# Altium project 新苗.PrjPCB
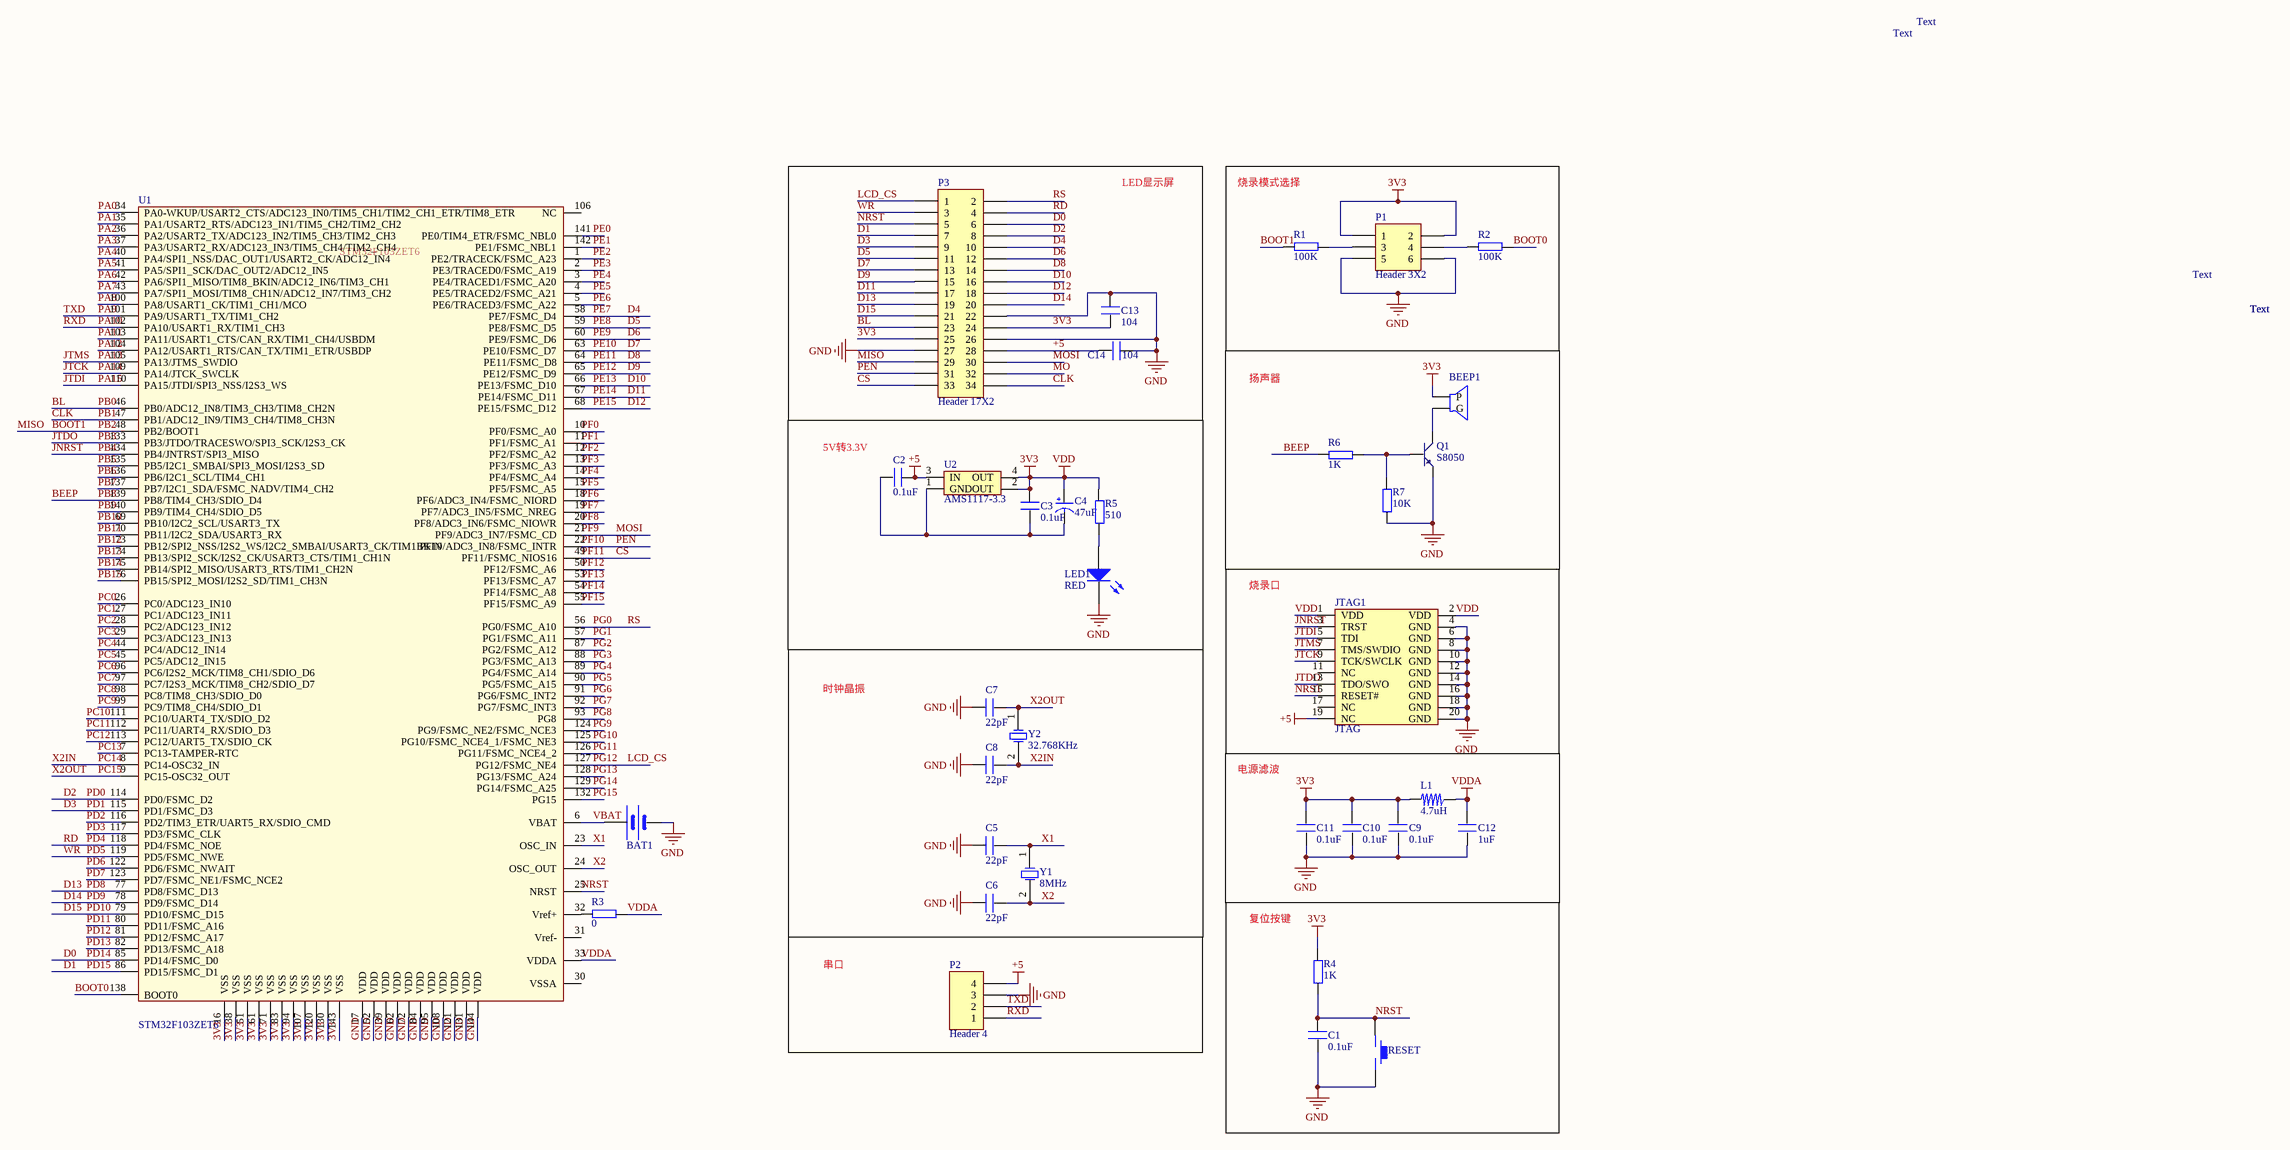
[diagram p0: 新苗.SchDoc]
1 sheet, 35 parts. Net scope: global (net labels, ports and power ports of the same name join across sheets).
Board file: 新苗.PcbDoc

## Sheet 新苗.SchDoc
size A3

### Parts
BAT1  BATT  [BATM]  (value not drawn)
BEEP1  BEEP  [BELL-5]  (value not drawn)
C1  0.1uF  [0603P]
C2  0.1uF  [0603P]
C3  0.1uF  [0603P]
C4  47uF  [CC6.56.5]
C5  22pF  [0603P]
C6  22pF  [0603P]
C7  22pF  [0603P]
C8  22pF  [0603P]
C9  0.1uF  [0603P]
C10  0.1uF  [0603P]
C11  0.1uF  [0603P]
C12  1uF  [0603P]
C13  104  [0603P]
C14  104  [0603P]
JTAG1  JTAG  [JTAG_20]
L1  4.7uH  [L_SOP74]
LED1  RED  [SMDLED]
P1  Header 3X2  [HDR2X3]
P2  Header 4  [HDR1X4]
P3  Header 17X2  [HDR2X17]
Q1  S8050  [SOT-23R]
R1  100K  [0603P]
R2  100K  [0603P]
R3  0  [0603P]
R4  1K  [0603P]
R5  510  [0603P]
R6  1K  [0603P]
R7  10K  [0603P]
RESET  KEY_M  [KEY_M]  (value not drawn)
U1  STM32F103ZET6  [LQFP144]
U2  AMS1117-3.3  [AMS1117]
Y1  8MHz  [XTAL_US]
Y2  32.768KHz  [XTAL_US]

### Blocks framed on the sheet
LED显示屏: C13 C14 P3
烧录模式选择: P1 R1 R2

### Nets
3V3: BEEP1.1(P) C3.2 C4.1(VCC) C9.2 C10.2 C11.2 C13.1 JTAG1.1(VDD) JTAG1.2(VDD) L1.2 P1.1 P1.2 P3.24 P3.25 R4.2 R5.2 U1.16(VSS) U1.38(VSS) U1.51(VSS) U1.61(VSS) U1.71(VSS) U1.83(VSS) U1.94(VSS) U1.107(VSS) U1.120(VSS) U1.130(VSS) U1.143(VSS) U2.2(OUT) U2.4(OUT)  [also labelled VDD]
+5: C2.1 C14.2 JTAG1.19(NC) P2.4 P3.28 U2.3(IN)
GND: BAT1.2(GND) C1.1 C5.1 C6.1 C7.1 C8.1 C9.1 C10.1 C11.1 C12.1 C13.2 C14.1 JTAG1.4(GND) JTAG1.6(GND) JTAG1.8(GND) JTAG1.10(GND) JTAG1.12(GND) JTAG1.14(GND) JTAG1.16(GND) JTAG1.18(GND) JTAG1.20(GND) LED1.2(K) P1.5 P1.6 P2.3 P3.22 P3.26 P3.27 Q1.1(E) R7.1 RESET.2 U1.17(VDD) U1.39(VDD) U1.52(VDD) U1.62(VDD) U1.72(VDD) U1.84(VDD) U1.95(VDD) U1.108(VDD) U1.121(VDD) U1.131(VDD) U1.144(VDD)
VDDA: C12.2 L1.1 R3.1 U1.33(VDDA)
BEEP: R6.1 U1.139(PB8/TIM4_CH3/SDIO_D4)  [also labelled PB8]
BL: P3.23 U1.46(PB0/ADC12_IN8/TIM3_CH3/TIM8_CH2N)  [also labelled PB0]
BOOT0: R2.1 U1.138(BOOT0)
BOOT1: P3.29 R1.2 U1.48(PB2/BOOT1)  [also labelled MISO, PB2]
CLK: P3.34 U1.47(PB1/ADC12_IN9/TIM3_CH4/TIM8_CH3N)  [also labelled PB1]
CS: P3.33 U1.49(PF11/FSMC_NIOS16)  [also labelled PF11]
D0: P3.6 U1.85(PD14/FSMC_D0)  [also labelled PD14]
D1: P3.7 U1.86(PD15/FSMC_D1)  [also labelled PD15]
D2: P3.8 U1.114(PD0/FSMC_D2)  [also labelled PD0]
D3: P3.9 U1.115(PD1/FSMC_D3)  [also labelled PD1]
D4: P3.10 U1.58(PE7/FSMC_D4)  [also labelled PE7]
D5: P3.11 U1.59(PE8/FSMC_D5)  [also labelled PE8]
D6: P3.12 U1.60(PE9/FSMC_D6)  [also labelled PE9]
D7: P3.13 U1.63(PE10/FSMC_D7)  [also labelled PE10]
D8: P3.14 U1.64(PE11/FSMC_D8)  [also labelled PE11]
D9: P3.15 U1.65(PE12/FSMC_D9)  [also labelled PE12]
D10: P3.16 U1.66(PE13/FSMC_D10)  [also labelled PE13]
D11: P3.17 U1.67(PE14/FSMC_D11)  [also labelled PE14]
D12: P3.18 U1.68(PE15/FSMC_D12)  [also labelled PE15]
D13: P3.19 U1.77(PD8/FSMC_D13)  [also labelled PD8]
D14: P3.20 U1.78(PD9/FSMC_D14)  [also labelled PD9]
D15: P3.21 U1.79(PD10/FSMC_D15)  [also labelled PD10]
JNRST: JTAG1.3(TRST) U1.134(PB4/JNTRST/SPI3_MISO)  [also labelled PB4]
JTCK: JTAG1.9(TCK/SWCLK) U1.109(PA14/JTCK_SWCLK)  [also labelled PA14]
JTDI: JTAG1.5(TDI) U1.110(PA15/JTDI/SPI3_NSS/I2S3_WS)  [also labelled PA15]
JTDO: JTAG1.13(TDO/SWO) U1.133(PB3/JTDO/TRACESWO/SPI3_SCK/I2S3_CK)  [also labelled PB3]
JTMS: JTAG1.7(TMS/SWDIO) U1.105(PA13/JTMS_SWDIO)  [also labelled PA13]
LCD_CS: P3.1 U1.127(PG12/FSMC_NE4)  [also labelled PG12]
MO: P3.32
MOSI: P3.30 U1.21(PF9/ADC3_IN7/FSMC_CD)  [also labelled PF9]
NRST: C1.2 JTAG1.15(RESET#) P3.5 R4.1 RESET.1 U1.25(NRST)
PA0: U1.34(PA0-WKUP/USART2_CTS/ADC123_IN0/TIM5_CH1/TIM2_CH1_ETR/TIM8_ETR)
PA1: U1.35(PA1/USART2_RTS/ADC123_IN1/TIM5_CH2/TIM2_CH2)
PA2: U1.36(PA2/USART2_TX/ADC123_IN2/TIM5_CH3/TIM2_CH3)
PA3: U1.37(PA3/USART2_RX/ADC123_IN3/TIM5_CH4/TIM2_CH4)
PA4: U1.40(PA4/SPI1_NSS/DAC_OUT1/USART2_CK/ADC12_IN4)
PA5: U1.41(PA5/SPI1_SCK/DAC_OUT2/ADC12_IN5)
PA6: U1.42(PA6/SPI1_MISO/TIM8_BKIN/ADC12_IN6/TIM3_CH1)
PA7: U1.43(PA7/SPI1_MOSI/TIM8_CH1N/ADC12_IN7/TIM3_CH2)
PA8: U1.100(PA8/USART1_CK/TIM1_CH1/MCO)
PA9: P2.2 U1.101(PA9/USART1_TX/TIM1_CH2)  [also labelled TXD]
PA10: P2.1 U1.102(PA10/USART1_RX/TIM1_CH3)  [also labelled RXD]
PA11: U1.103(PA11/USART1_CTS/CAN_RX/TIM1_CH4/USBDM)
PA12: U1.104(PA12/USART1_RTS/CAN_TX/TIM1_ETR/USBDP)
PB5: U1.135(PB5/I2C1_SMBAI/SPI3_MOSI/I2S3_SD)
PB6: U1.136(PB6/I2C1_SCL/TIM4_CH1)
PB7: U1.137(PB7/I2C1_SDA/FSMC_NADV/TIM4_CH2)
PB9: U1.140(PB9/TIM4_CH4/SDIO_D5)
PB10: U1.69(PB10/I2C2_SCL/USART3_TX)
PB11: U1.70(PB11/I2C2_SDA/USART3_RX)
PB12: U1.73(PB12/SPI2_NSS/I2S2_WS/I2C2_SMBAI/USART3_CK/TIM1BKIN)
PB13: U1.74(PB13/SPI2_SCK/I2S2_CK/USART3_CTS/TIM1_CH1N)
PB14: U1.75(PB14/SPI2_MISO/USART3_RTS/TIM1_CH2N)
PB15: U1.76(PB15/SPI2_MOSI/I2S2_SD/TIM1_CH3N)
PC0: U1.26(PC0/ADC123_IN10)
PC1: U1.27(PC1/ADC123_IN11)
PC2: U1.28(PC2/ADC123_IN12)
PC3: U1.29(PC3/ADC123_IN13)
PC4: U1.44(PC4/ADC12_IN14)
PC5: U1.45(PC5/ADC12_IN15)
PC6: U1.96(PC6/I2S2_MCK/TIM8_CH1/SDIO_D6)
PC7: U1.97(PC7/I2S3_MCK/TIM8_CH2/SDIO_D7)
PC8: U1.98(PC8/TIM8_CH3/SDIO_D0)
PC9: U1.99(PC9/TIM8_CH4/SDIO_D1)
PC10: U1.111(PC10/UART4_TX/SDIO_D2)
PC11: U1.112(PC11/UART4_RX/SDIO_D3)
PC12: U1.113(PC12/UART5_TX/SDIO_CK)
PC13: U1.7(PC13-TAMPER-RTC)
PC14: C8.2 U1.8(PC14-OSC32_IN) Y2.2(OSC2)  [also labelled X2IN]
PC15: C7.2 U1.9(PC15-OSC32_OUT) Y2.1(OSC1)  [also labelled X2OUT]
PD2: U1.116(PD2/TIM3_ETR/UART5_RX/SDIO_CMD)
PD3: U1.117(PD3/FSMC_CLK)
PD4: P3.4 U1.118(PD4/FSMC_NOE)  [also labelled RD]
PD5: P3.3 U1.119(PD5/FSMC_NWE)  [also labelled WR]
PD6: U1.122(PD6/FSMC_NWAIT)
PD7: U1.123(PD7/FSMC_NE1/FSMC_NCE2)
PD11: U1.80(PD11/FSMC_A16)
PD12: U1.81(PD12/FSMC_A17)
PD13: U1.82(PD13/FSMC_A18)
PE0: U1.141(PE0/TIM4_ETR/FSMC_NBL0)
PE1: U1.142(PE1/FSMC_NBL1)
PE2: U1.1(PE2/TRACECK/FSMC_A23)
PE3: U1.2(PE3/TRACED0/FSMC_A19)
PE4: U1.3(PE4/TRACED1/FSMC_A20)
PE5: U1.4(PE5/TRACED2/FSMC_A21)
PE6: U1.5(PE6/TRACED3/FSMC_A22)
PEN: P3.31 U1.22(PF10/ADC3_IN8/FSMC_INTR)  [also labelled PF10]
PF0: U1.10(PF0/FSMC_A0)
PF1: U1.11(PF1/FSMC_A1)
PF2: U1.12(PF2/FSMC_A2)
PF3: U1.13(PF3/FSMC_A3)
PF4: U1.14(PF4/FSMC_A4)
PF5: U1.15(PF5/FSMC_A5)
PF6: U1.18(PF6/ADC3_IN4/FSMC_NIORD)
PF7: U1.19(PF7/ADC3_IN5/FSMC_NREG)
PF8: U1.20(PF8/ADC3_IN6/FSMC_NIOWR)
PF12: U1.50(PF12/FSMC_A6)
PF13: U1.53(PF13/FSMC_A7)
PF14: U1.54(PF14/FSMC_A8)
PF15: U1.55(PF15/FSMC_A9)
PG0: P3.2 U1.56(PG0/FSMC_A10)  [also labelled RS]
PG1: U1.57(PG1/FSMC_A11)
PG2: U1.87(PG2/FSMC_A12)
PG3: U1.88(PG3/FSMC_A13)
PG4: U1.89(PG4/FSMC_A14)
PG5: U1.90(PG5/FSMC_A15)
PG6: U1.91(PG6/FSMC_INT2)
PG7: U1.92(PG7/FSMC_INT3)
PG8: U1.93(PG8)
PG9: U1.124(PG9/FSMC_NE2/FSMC_NCE3)
PG10: U1.125(PG10/FSMC_NCE4_1/FSMC_NE3)
PG11: U1.126(PG11/FSMC_NCE4_2)
PG13: U1.128(PG13/FSMC_A24)
PG14: U1.129(PG14/FSMC_A25)
PG15: U1.132(PG15)
VBAT: BAT1.1(VCC) U1.6(VBAT)
X1: C5.2 U1.23(OSC_IN) Y1.1(OSC1)
X2: C6.2 U1.24(OSC_OUT) Y1.2(OSC2)
NetBEEP1_2: BEEP1.2(G) Q1.3(C)
NetC2_2: C2.2 C3.1 C4.2(GND) U2.1(GND)
NetLED1_1: LED1.1(A) R5.1
NetP1_3: P1.3 R1.1
NetP1_4: P1.4 R2.2
NetQ1_2: Q1.2(B) R6.2 R7.2
NetR3_2: R3.2 U1.32(Vref+)

Not connected (* = marked no-connect by the designer): JTAG1 11(NC) 17(NC); U1 30(VSSA) 31(Vref-) 106(NC)

### Notes on the sheet
- Text
- (near U1) STM32F103ZET6
- 扬声器
- (near C2) 5V转3.3V
- 烧录口
- 时钟晶振
- 电源滤波
- 复位按键
- 串口
- Title
- Size:
- Date:
- A3
- Number:
- Time:
- Revision:
- Sheet
- of
- File:

### Library data of the parts
BAT1 = BAT
C1-C3 C5-C14 = C
C4 = CAP
L1 = L_SOP
LED1 = LED2: Typical RED, GREEN, YELLOW, AMBER GaAs LED; Published: 8-Jun-2000; LatestRevisionDate: 17-Jul-2002; LatestRevisionNote: Re-released for DXP Platform.; PackageDocument: Feb-2002; PackageReference: 3.2X1.6X1.1; Publisher: Altium Limited
P1 = Header 3X2: Header, 3-Pin, Dual row; LatestRevisionDate: 17-Jul-2002; LatestRevisionNote: Re-released for DXP Platform.; Publisher: Altium Limited
P2 = Header 4: Header, 4-Pin; LatestRevisionDate: 17-Jul-2002; LatestRevisionNote: Re-released for DXP Platform.; Publisher: Altium Limited
P3 = Header 17X2: Header, 17-Pin, Dual row; LatestRevisionDate: 17-Jul-2002; LatestRevisionNote: Re-released for DXP Platform.; Publisher: Altium Limited
Q1 = NPN: 8050/BCW846/BCW847
R1-R7 = R
U2 = AMS1117
Y1 Y2 = XTAL: Crystal Oscillator; Published: 8-Jun-2000; LatestRevisionDate: 17-Jul-2002; LatestRevisionNote: Re-released for DXP Platform.; Publisher: Altium Limited